# Altium project Hamburger_PCB.PrjPcb
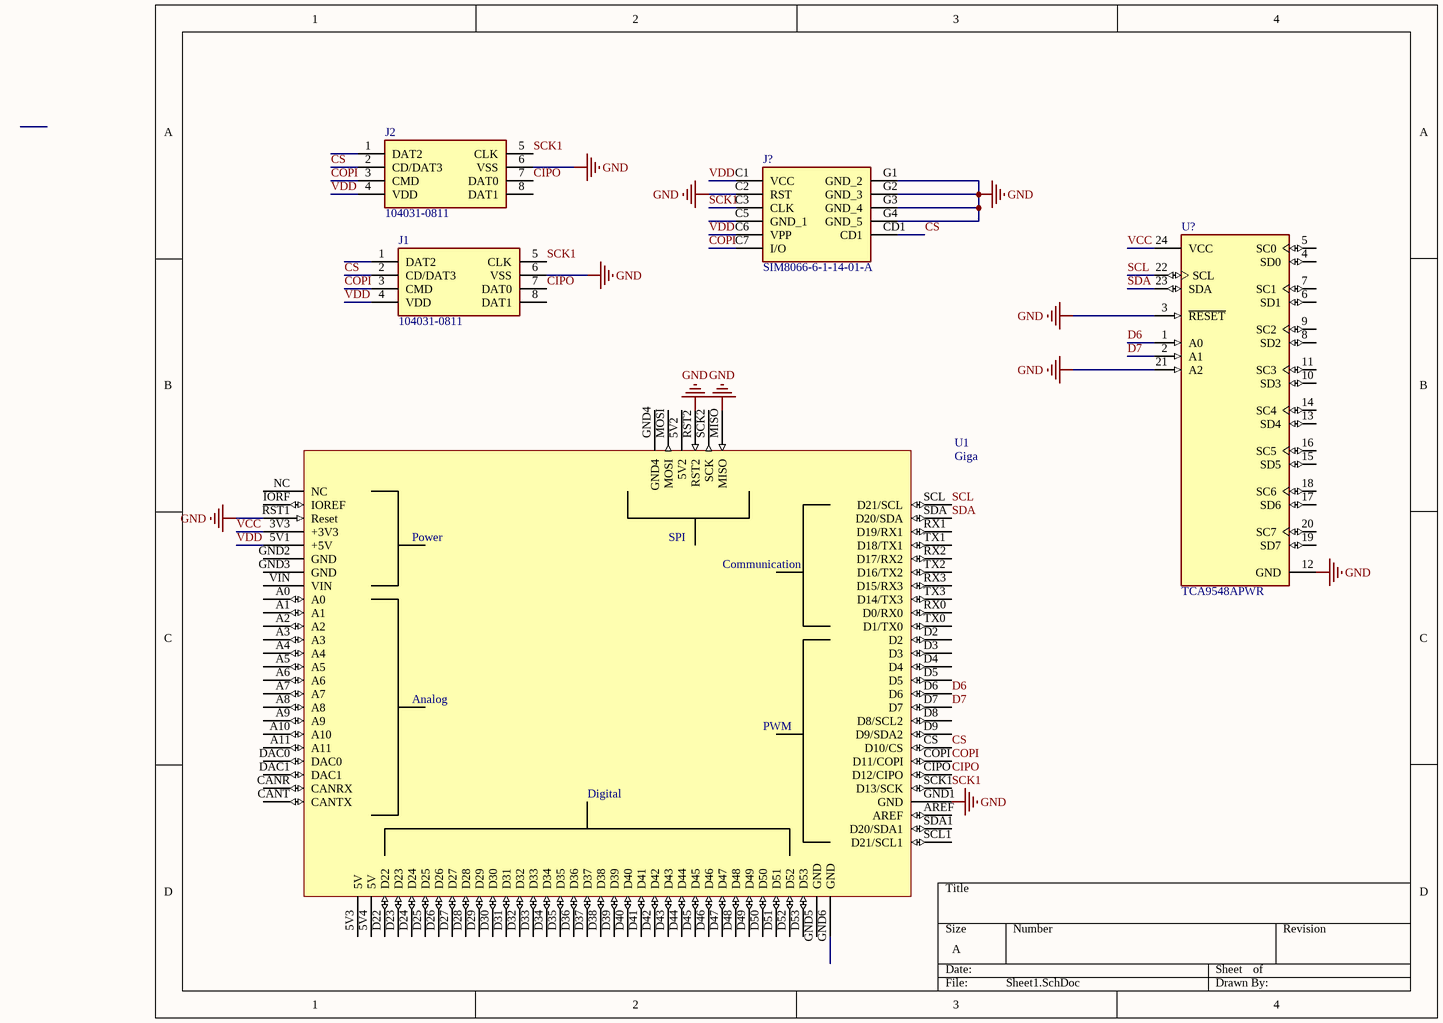
[diagram p0: Sheet1.SchDoc]
1 sheet, 5 parts. Net scope: global (net labels, ports and power ports of the same name join across sheets).
Board file: PCB1.PcbDoc

## Sheet Sheet1.SchDoc
size A; SheetNumber: 1; SheetTotal: 1

### Parts
J1  104031-0811  [1040310811]
J2  104031-0811  [1040310811]
J?  SIM8066-6-1-14-01-A  [SIM8066611401A]
U1  Giga  [Arduino_Giga_R1_WiFi_Shield]
U?  TCA9548APWR  [FP-PW0024A-MFG]

### Nets
GND: J1.6(VSS) J2.6(VSS) J?.C2(RST) J?.G1(GND_2) J?.G2(GND_3) J?.G3(GND_4) J?.G4(GND_5) U1.GND1(GND) U1.MISO U1.RST1(Reset) U1.RST2 U?.3(~{RESET}) U?.12(GND) U?.21(A2)
CIPO: J1.7(DAT0) J2.7(DAT0) U1.CIPO(D12/CIPO)
COPI: J1.3(CMD) J2.3(CMD) J?.C7(I/O) U1.COPI(D11/COPI)
CS: J1.2(CD/DAT3) J2.2(CD/DAT3) J?.CD1 U1.CS(D10/CS)
D6: U1.D6 U?.1(A0)
D7: U1.D7 U?.2(A1)
SCK1: J1.5(CLK) J2.5(CLK) J?.C3(CLK) U1.SCK1(D13/SCK)
SCL: U1.SCL(D21/SCL) U?.22(SCL)
SDA: U1.SDA(D20/SDA) U?.23(SDA)
VCC: U1.3V3(+3V3) U?.24(VCC)
VDD: J1.4(VDD) J2.4(VDD) J?.C1(VCC) J?.C6(VPP) U1.5V1(+5V)

Not connected (* = marked no-connect by the designer): J1 1(DAT2) 8(DAT1); J2 1(DAT2) 8(DAT1); J? C5(GND_1); U1 5V2 5V3(5V) 5V4(5V) A0 A1 A2 A3 A4 A5 A6 A7 A8 A9 A10 A11 AREF CANR(CANRX) CANT(CANTX) D2 D3 D4 D5 D8(D8/SCL2) D9(D9/SDA2) D22 D23 D24 D25 D26 D27 D28 D29 D30 D31 D32 D33 D34 D35 D36 D37 D38 D39 D40 D41 D42 D43 D44 D45 D46 D47 D48 D49 D50 D51 D52 D53 DAC0 DAC1 GND2(GND) GND3(GND) GND4 GND5(GND) GND6(GND) IORF(IOREF) MOSI NC RX0(D0/RX0) RX1(D19/RX1) RX2(D17/RX2) RX3(D15/RX3) SCK2(SCK) SCL1(D21/SCL1) SDA1(D20/SDA1) TX0(D1/TX0) TX1(D18/TX1) TX2(D16/TX2) TX3(D14/TX3) VIN; U? 4(SD0) 5(SC0) 6(SD1) 7(SC1) 8(SD2) 9(SC2) 10(SD3) 11(SC3) 13(SD4) 14(SC4) 15(SD5) 16(SC5) 17(SD6) 18(SC6) 19(SD7) 20(SC7)

### Notes on the sheet
- (in symbol Component_1) Power; SPI; Communication; Analog; PWM; Digital

### Library data of the parts
J1 J2 = 104031-0811: Connector; Manufacturer_Name: Molex; Datasheet Link: http://www.molex.com/webdocs/datasheets/pdf/en-us/1040310811_MEMORY_CARD_SOCKET.pdf; Manufacturer_Part_Number: 104031-0811; Mouser Part Number: 538-104031-0811; Mouser Price/Stock: https://www.mouser.co.uk/ProductDetail/Molex/104031-0811?qs=udsGRKD4nA3Tvy7wqky%252BuA%3D%3D
J? = SIM8066-6-1-14-01-A: Connector; Manufacturer_Name: GCT (GLOBAL CONNECTOR TECHNOLOGY); Datasheet Link: https://gct.co/connector/sim8066; Height: 1.64mm; Manufacturer_Part_Number: SIM8066-6-1-14-01-A; Mouser Part Number: 640-SIM8066-611401A; Mouser Price/Stock: https://www.mouser.co.uk/ProductDetail/GCT/SIM8066-6-1-14-01-A?qs=TuK3vfAjtkWgq0pKcqnMSw%3D%3D
U1 = Component_1
U? = CMP-04892-000002-1: IC I2C SW 8CH W/RESET 24TSSOP; Manufacturer: Texas Instruments; Number Of Circuits: 1; Mux Demux Ratio: 1:8; Nominal Supply Current: 2-50uA; Interface: I2C,SMBus; Min Supply Voltage: 1.65V; Standoff Height: 0.05mm; Max Supply Voltage: 5.5V; Device Class L2: Interface ICs; ComponentLink2Description: Datasheet; Ipc Land Pattern Name: SOP65P640X120-24; Category: IC; Device Class L1: Integrated Circuits (ICs); Manufacturer Part Number: TCA9548APWR; RoHS: TRUE; Temperature Range High: +85°C; Digikey Description: IC I2C SW 8CH W/RESET 24TSSOP; Temperature Range Low: -40°C; Lead Free: Yes; Package: PW0024A; ComponentLink2URL: http://www.ti.com/lit/ds/symlink/tca9548a.pdf; Device Class L3: Multiplexers; Ambient Temperature Range Low: -40°C; Mouser Description: Low-Voltage 8-Channel I2C Switch With Reset 24-TSSOP -40 to 85; Temperature: -40°C to +85°C; Octopart: https://octopart.com/tca9548apwr-texas+instruments-22266789; Ambient Temperature Range High: +85°C; Automotive: No; Height: 1.2mm